# Altium schematic sheet DataDriven_sheet4_sim_connectors.SchDoc
size A3; SheetNumber: 4; SheetTotal: 4
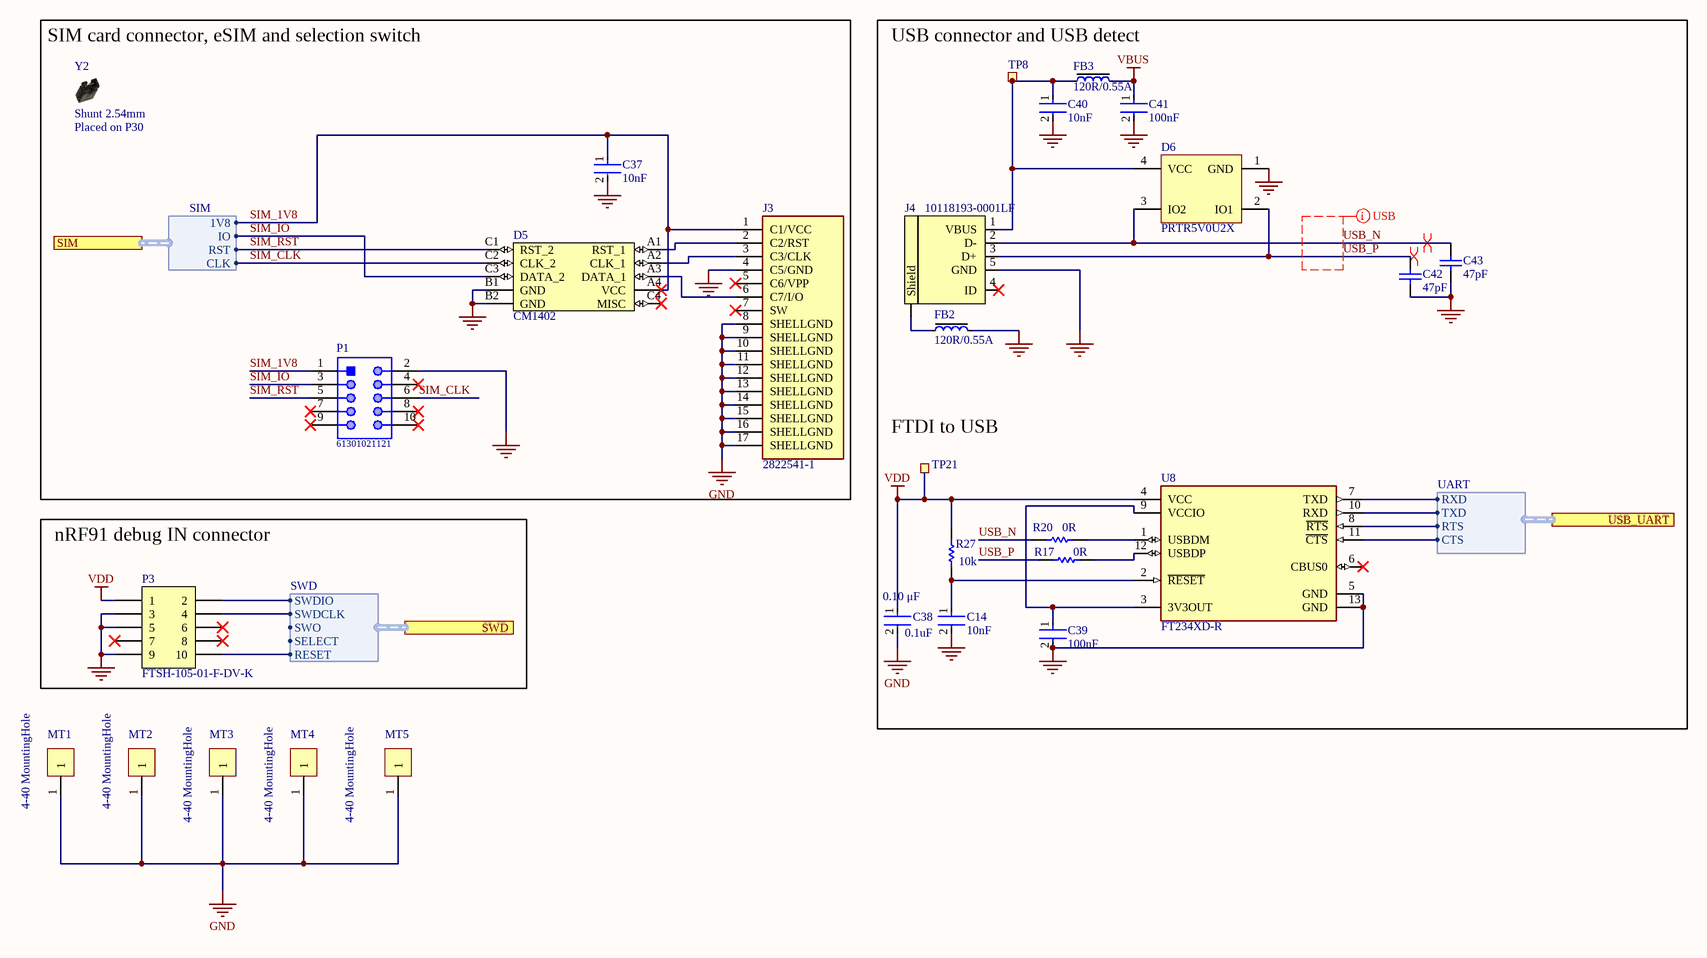
[diagram p0: DataDriven_sheet4_sim_connectors.SchDoc]

## Parts
C14  10nF  [FP-CC0603-DA-MFG]
C37  10nF  [FP-CC0603-DA-MFG]
C38  0.1uF  Capacitance: 0.10 μF  [FP-C0603C-CF-MFG]
C39  100nF  [FP-CGA3E-0_3-0_1-IPC_A]
C40  10nF  [FP-CC0603-DA-MFG]
C41  100nF  [FP-CGA3E-0_3-0_1-MFG]
C42  47pF  [CAPC1608X90X35ML10T15]
C43  47pF  [CAPC1608X90X35ML10T15]
D5  CM1402  [CM1402]
D6  PRTR5V0U2X  [SOT190P230X110-4L]
FB2  120R/0.55A  [INDC1005X04L]
FB3  120R/0.55A  [INDC1005X04L]
J3  2822541-1  [TE_2822541-1]
J4  10118193-0001LF  [USB-Micro-B-RA-SMD-PiP]
MT1  4-40 MountingHole  [4-40 Mounting Hole]
MT2  4-40 MountingHole  [4-40 Mounting Hole]
MT3  4-40 MountingHole  [4-40 Mounting Hole]
MT4  4-40 MountingHole  [4-40 Mounting Hole]
MT5  4-40 MountingHole  [4-40 Mounting Hole]
P1  61301021121  [61301021121]
P3  FTSH-105-01-F-DV-K  [HDR_2x5-SMD-1.27mm-K]
R17  0R  [RESC1608X55X25ML10T15]
R20  0R  [RESC1608X55X25ML10T15]
R27  10k  [RESC1609X55X30LL15T15]
TP8  Ø1.5mm,SMD  [TP_SMD_D1.5mm]  (value not drawn)  (no BOM)
TP21  Ø1.5mm,SMD  [TP_SMD_D1.5mm]  (value not drawn)  (no BOM)
U8  FT234XD-R  [FP-DFN-12-MFG]
Y2  Shunt 2.54mm  Assembly: Placed on P30  [Shunt_2.54mm_Horizontal]  (mechanical)

## Blocks framed on the sheet
SIM card connector, eSIM and selection switch: C37 D5 J3 P1 Y2
nRF91 debug IN connector: P3

## Ports
SIM (harness SIM, see DataDriven_sheet1_connections[3B], DataDriven_sheet2_nRF9160[7B]), SWD (harness SWD, see DataDriven_sheet1_connections[3B], DataDriven_sheet2_nRF9160[7A]), USB_UART (harness UART, see DataDriven_sheet1_connections[3B], DataDriven_sheet2_nRF9160[7A])

## Harnesses
SWD: SWDIO, SWDCLK, SWO, RESET, SELECT
SIM: CLK, IO, 1V8, RST
UART: RTS, CTS, RXD, TXD

## Nets
GND: C14.2 C37.2 C38.2 C39.2 C40.2 C41.2 C42.1 C43.1 D5.B1(GND) D5.B2(GND) D6.1(GND) FB2.2 J3.4(C5/GND) J3.8(SHELLGND) J3.9(SHELLGND) J3.10(SHELLGND) J3.11(SHELLGND) J3.12(SHELLGND) J3.13(SHELLGND) J3.14(SHELLGND) J3.15(SHELLGND) J3.16(SHELLGND) J3.17(SHELLGND) J4.5(GND) MT1.1 MT2.1 MT3.1 MT4.1 MT5.1 P1.2 P3.3 P3.5 P3.9 U8.5(GND) U8.13(GND)
VBUS: C41.1 FB3.2
VDD: C38.1 P3.1 R27.1 TP21.1 U8.4(VCC)
SIM_1V8: C37.1 D5.A4(VCC) J3.1(C1/VCC) P1.1 ; port SIM.1V8
SIM_CLK: D5.C2(CLK_2) P1.6 ; port SIM.CLK
SIM_IO: D5.C3(DATA_2) P1.3 ; port SIM.IO
SIM_RST: D5.C1(RST_2) P1.5 ; port SIM.RST
USB_N: C43.2 D6.3(IO2) J4.2(D-) R20.1
USB_P: C42.2 D6.2(IO1) J4.3(D+) R17.1
NetC14_1: C14.1 R27.2 U8.2(~{RESET})
NetC39_1: C39.1 U8.3(3V3OUT) U8.9(VCCIO)
NetC40_1: C40.1 D6.4(VCC) FB3.1 J4.1(VBUS) TP8.1
NetD5_A1: D5.A1(RST_1) J3.2(C2/RST)
NetD5_A2: D5.A2(CLK_1) J3.3(C3/CLK)
NetD5_A3: D5.A3(DATA_1) J3.6(C7/I/O)
NetFB2_1: FB2.1 J4.6(Shield)
NetP3_2: P3.2 ; port SWD.SWDIO
NetP3_4: P3.4 ; port SWD.SWDCLK
NetP3_10: P3.10 ; port SWD.RESET
NetR17_2: R17.2 U8.12(USBDP)
NetR20_2: R20.2 U8.1(USBDM)
NetU8_7: U8.7(TXD) ; port USB_UART.RXD
NetU8_8: U8.8(~{RTS}) ; port USB_UART.RTS
NetU8_10: U8.10(RXD) ; port USB_UART.TXD
NetU8_11: U8.11(~{CTS}) ; port USB_UART.CTS

Not connected (* = marked no-connect by the designer): D5 C4(MISC)*; J3 5(C6/VPP)* 7(SW)*; J4 4(ID)*; P1 4* 7* 8* 9* 10*; P3 6* 7* 8*; U8 6(CBUS0)*

## Layout directives
differential pair: USB_N, USB_P
net class USB: USB_N, USB_P

## Notes on the sheet
- USB connector and USB detect
- (near TP21) FTDI to USB

## Library data of the parts
C14 C37 C40 = CMP-2100-03600-2: CAP CER 10000PF 50V X7R 0603; Manufacturer Part Number: CC0603KRX7R9BB103; Manufacturer: YAGEO; Tolerance: 0.1; Material: Ceramic; Temperature Coefficient: 15%; Mouser Description: Multilayer Ceramic Capacitor, CC Series, 0.01 - F, - 10%, X7R, 50 V, 0603 [1608 Metric]; Digikey Description: CAP CER 10000PF 50V X7R 0603; Height: 0.9mm; Category: Cap; Temperature Characteristic: X7R; Footprint Url: http://www.yageo.com/exep/pages/download/literatures/UPY-C_GEN_24.pdf; Lead Free: Yes; Voltage Rating: 50 V; Temperature: -55°C to +125°C; Device Class L3: Ceramic Capacitors; ComponentLink2Description: Datasheet; Voltage: 50 V; Package: CC0603-DA; Octopart: https://octopart.com/cc0603krx7r9bb103-yageo-192938; Automotive: No; Temperature Range High: +125°C; Temperature Range Low: -55°C; Value: 10 nF; RoHS: TRUE; Device Class L1: Passive Components; ComponentLink2URL: http://www.yageo.com/documents/recent/UPY-GPHC_X7R_6.3V-to-50V_18.pdf; Device Class L2: Capacitors; Capacitance: 10 nF
  C37: Part Number: CC0603KRX7R9BB103
C38 = CMP-2006-03061-2: CAP CER 0.1UF 50V X7R 0603; Manufacturer: KEMET; Manufacturer Part Number: C0603C104K5RACTU; Tolerance: 0.1; Temperature Coefficient: 30ppm/°C; Material: Ceramic; Automotive Grade: Grade 1; Value: 0.10 μF; Temperature: -55°C to +125°C; RoHS: TRUE; Temperature Range High: +125°C; Lead Free: Yes; Octopart: https://octopart.com/c0603c104k5ractu-kemet-139244; Digikey Description: CAP CER 0.1UF 50V X7R 0603; Category: Cap; Package: C0603C-CF; ComponentLink2Description: Datasheet; Temperature Range Low: -55°C; Device Class L1: Passive Components; Voltage Rating: 50 V; Automotive: Yes; Device Class L3: Ceramic Capacitors; ComponentLink2URL: https://api.kemet.com/component-edge/download/datasheet/C0603C100J5GACAUTO.pdf; Device Class L2: Capacitors; Temperature Characteristic: X7R; Height: 0.87mm
C39 C41 = CMP-2000-07546-2: Cap Ceramic 100nF 50V X7R 10% Pad SMD 0603 +125°C Automotive T/R; Manufacturer: TDK; Manufacturer Part Number: CGA3E2X7R1H104K080AA; Weight: 7.1E-05oz; Composition: Ceramic; Max Operating Temperature: 125°C; Termination: SMD/SMT; Dielectric: X7R; Length: 1.6mm; Package Quantity: 1; REACH SVHC: No SVHC; Lead Free: Lead Free; Case Code (Metric): 1608; Min Operating Temperature: -55°C; Packaging: Tape and Reel; Tolerance: 10%; Voltage Rating: 50V; Case Code (Imperial): 0603; Capacitance: 100nF; Case/Package: 0603; Voltage Rating (DC): 50V; Depth: 0.8mm; Radiation Hardening: No; Ratings: AEC-Q200; Mount: Surface Mount; Voltage: 50V; Thickness: 0.035inch; Width: 0.8mm; Height: 0.8mm; Part Number: CGA3E2X7R1H104K080AA
  C41: Parameter 1: *
C42 C43 = CMP-2006-02672-1: 47 pF ±5% 50V Ceramic Capacitor C0G, NP0 0603 (1608 Metric); Manufacturer: Murata; Part Number: GRM1885C1H470JA01D; Manufacturer Part Number: GRM1885C1H470JA01D
D5 = CM1402: EMI Network Filter Arrays SIM CARD EMI FILTER WITH ESD PROTECTION; Manufacturer: ON Semiconductor; Manufacturer Part Number: CM1402-03CP; Part number IPS: 00000009949; Note: N.A.; Pad Count: 10; Part Number: CM1402; Footprint Doc: CM1402; LatestRevisionDate: 2017-02-06; Published: 2017-02-06; Value: CM1402; Artikkelnr Noca: N.A.; ComponentLink1URL: N.A.; ComponentLink1Description: Datasheet; ComponentLink2URL: N.A.; ComponentLink2Description: Supplier link; HelpURL: http://www.onsemi.com/pub_link/Collateral/CM1402-D.PDF; Supplier 1: Digi-Key; Supplier Part Number 1: CM1402-03CPOSTR-ND; Supplier 2: Mouser; Supplier Part Number 2: 748-CM1402-03CP; PartId: 101300139; Component Class: Semiconductors; Author: rsk; Part number Norautron: N.A.
D6 = PRTR5V0U2X: Ultra low capacitance double rail-to-rail ESD protection diode; Manufacturer: NXP Semiconductors; Part number IPS: 00000009951; Note: N.A.; Artikkelnr Noca: 10069015; Pad Count: 4; Part Number: PRTR5V0U2X; Manufacturer Part Number: PRTR5V0U2X; LatestRevisionDate: 2017-11-09; Published: 2012-06-11; Value: PRTR5V0U2X; Footprint Doc: SOT-143B; ComponentLink1URL: N.A.; ComponentLink1Description: Datasheet; ComponentLink2URL: N.A.; ComponentLink2Description: Supplier link; HelpURL: http://www.farnell.com/datasheets/109718.pdf; Supplier 1: Digi-Key; Supplier Part Number 1: 568-4140-1-ND; Supplier 2: Farnell; Supplier Part Number 2: 152-4157; PartId: 101300082; Component Class: Semiconductors; Author: rsk; Part number Norautron: N.A.
FB2 FB3 = FB0402-120R@100M-500mA: Ferrite Bead, 120 Ohm @ 100MHz, 500mA, 250 mOhm Max; Manufacturer: Murata; Manufacturer Part Number: BLM15AG121SN1D; Part number IPS: 00000009954; Part number Norautron: N.A.; Note: Chip EMIFIL Inductor Type Chip Ferrite Bead; Artikkelnr Noca: 33029317; Pad Count: 2; Part Number: FB0402-120R@100M-500mA; Footprint Doc: 0402; LatestRevisionDate: 2014-01-10; Published: 2011-11-14; Value: 120R/0.55A; ComponentLink1URL: N.A.; ComponentLink1Description: Datasheet; ComponentLink2URL: N.A.; ComponentLink2Description: Supplier link; HelpURL: http://search.murata.co.jp/Ceramy/image/img/PDF/ENG/L0110S0100BLM15A_SN.pdf; Supplier 1: Digi-Key; Supplier Part Number 1: 490-1005-1-ND; Supplier 2: Farnell; Supplier Part Number 2: 151-5760; PartId: 100300099; Component Class: Inductors; Author: rsk
J3 = 2822541-1: 7 _6 + 1_ Position Card Connector Micro SIM Surface Mount, Right Angle Gold; Manufacturer: TE Connectivity AMP Connectors; MF: TE Connectivity; Value: *; MP: 2822541-1; TE_purchase_URL: https://www.te.com/usa-en/product-2822541-1.html?te_bu=Cor&te_type=disp&te_campaign=seda_glo_cor-seda-global-disp-prtnr-fy19-seda-model-bom-cta_sma-317_1&elqCampaignId=32493; Package: None; SnapEDA_Link: https://www.snapeda.com/parts/2822541-1/TE%20Connectivity%20AMP%20Connectors/view-part/2624949/?ref=snap; Digi-Key_Part_Number: A141365CT-ND; Digi-Key_Purchase_URL: https://www.digikey.vn/product-detail/en/te-connectivity-amp-connectors/2822541-1/A141365CT-ND/9564398?utm_source=snapeda&utm_medium=aggregator&utm_campaign=symbol; Manufacturer Part Number: 2822541; Part Number: 2822541
J4 = USB-Micro-B-RA-SMD-PiP: USB - micro B USB 2.0 Receptacle Connector 5 Position Surface Mount, Right Angle; Through Hole; Manufacturer: Amphenol ICC (FCI); Part number IPS: 00000007790; Value: MicroUSB-B; Note: N.A.; Artikkelnr Noca: 55029020; Pad Count: 5; Part Number: 10118193-0001LF; Manufacturer Part Number: 10118193-0001LF; Footprint Doc: 10118193-0001LF; LatestRevisionDate: 2016-04-21; Published: 2014-10-07; ComponentLink1URL: N.A.; ComponentLink1Description: Datasheet; ComponentLink2URL: N.A.; ComponentLink2Description: Supplier link; HelpURL: \\hizz\pro\app9717\Datasheet\connectors\Allen Creations Corp\AJU-211.pdf; Supplier 1: Cabcon; Supplier Part Number 1: AJU55-BS2111-L; Supplier 2: Digi-Key; Supplier Part Number 2: 609-4616-1-ND; PartId: 100500490; Component Class: Connectors; Author: rsk; Part number Norautron: N.A.
MT1-MT5 = 4-40 MountingHole: 4-40 Mounting Hole
P1 = CMP-1502-01084-1: THT Vertical Pin Header WR-PHD, Pitch 2.54 mm, Dual Row, 10 pins; Manufacturer: Wurth Elektronik; Working Voltage: 250VAC; Pitch: 2.54mm; Contact Resistance: 20mOhm; Gender: Male; Rated Current: 3A; Withstanding Voltage: 500VAC; Pin Number: 10; Operating Temperature: -40to105degC; Mounting Technology: THT; Publisher: WurthElektronik; Manufacturer URL: http://www.we-online.de; Part Number: 61301021121; Row Number: Dual; Packaging: Bag; Orientation: Vertical; Package Reference: 61301021121; Datasheet URL: https://katalog.we-online.de/em/datasheet/6130xx21121.pdf; Manufacturer Part Number: 61301021121
P3 = Pin Header 2x5 SMD, 1.27mm, KS: Pin Header 2x5, 1.27mm (50mil), SMD, Keying Shroud; Manufacturer: Samtec; Part number IPS: 00000009968; Note: N.A.; Artikkelnr Noca: 55010009; Pad Count: 10; Part Number: Pin Header 2x5 SMD, 1.27mm, KS; Manufacturer Part Number: FTSH-105-01-F-DV-K; Footprint Doc: HDR_2x5-SMD-1.27mm; LatestRevisionDate: 2016-04-21; Published: 2016-01-22; Value: Pin Header 2x5, 1.27mm; ComponentLink1URL: N.A.; ComponentLink1Description: Datasheet; ComponentLink2URL: N.A.; ComponentLink2Description: Supplier link; HelpURL: \\hizz\pro\app9717\Datasheet\connectors\W-CON\3132-XXMXXBK00XX.pdf; Supplier 1: Cabcon; Supplier Part Number 1: 3132-10MS0BK00R1; Supplier 2: Samtec; Supplier Part Number 2: FTSH-105-01-F-DV-K; PartId: 100500261; Component Class: Connectors; Author: rsk; Part number Norautron: N.A.
R17 R20 = CMP-2100-03667-1: Chip Resistor, 0 Ohm, +/- 5%, 0.1 W, -55 to 155 degC, 0603 (1608 Metric), RoHS, Tape and Reel; Manufacturer: Yageo; Manufacturer Part Number: RC0603JR-070RL; Temperature Coefficient: 200ppm/degreesC; Voltage Rating: 50V; Power Rating: 100mW; Resistance: 0mOhm; Width: 0.8mm; Max Operating Temperature: 155degC; Tolerance: 5%; Package Reference: 0603; Height: 0.45mm; Depth: 0.8mm; Package Description: 2-Pin Surface Mount Device, Body 1.6 x 0.8 mm; Termination: SMD/SMT; Package Quantity: 5000; Case/Package: 0603; Case Code (Imperial): 0603; Radiation Hardening: No; Number of Pins: 2; Length: 1.6mm; Lead Free: LeadFree; Voltage Rating (DC): 50V; Military Standard: Not; Datasheet URL: http://www.yageo.com/NewPortal/yageodocoutput?fileName=/pdf/R-Chip/PYu-RC_Group_51_RoHS_L_5.pdf; Manufacturer URL: http://www.yageo.com/; Packaging: TapeandReel; Case Code (Metric): 1608; Min Operating Temperature: -55degC; Composition: ThickFilm; RoHSCompliant: true; Contact Plating: Tin; Datasheet Version: Rev. 5, 10/2016; REACH SVHC: NoSVHC; Part Number: RC0603JR-070RL
R27 = CMP-1012-00623-3: Chip Resistor, 10 KOhm, +/- 1%, 0.1 W, -55 to 155 degC, 0603 (1608 Metric), RoHS, Tape and Reel; Manufacturer: Panasonic; Manufacturer Part Number: ERJ-3EKF1002V; Voltage Rating: 75V; Case\/Package: 0603; Power Rating: 100mW; Resistance: 10KOhm; Temperature Coefficient: 100ppm\/degreesC; Number of Pins: 2; Package Reference: 603; Depth: 0.8mm; Mount: SurfaceMount; Package Description: 2-Pin Surface Mount Device, Body 1.6 x 0.85 mm; Datasheet Version: 02/2017; Length: 1.6mm; Lead Free: LeadFree; Height: 0.45mm; Number of Terminations: 2; Max Power Dissipation: 100mW; Min Operating Temperature: -55degC; Datasheet URL: https://industrial.panasonic.com/cdbs/www-data/pdf/RDA0000/AOA0000C304.pdf; Termination: SMD/SMT; Case Code (Metric): 1608; Case Code (Imperial): 0603; Tolerance: 1%; Max Operating Temperature: 155degC; RoHSCompliant: true; Voltage Rating (DC): 75V; Radiation Hardening: No; Packaging: TapeandReel; Composition: ThickFilm; Mounting Technology: SurfaceMount; Manufacturer URL: http://www.panasonic.com/; Width: 0.031inch; REACH SVHC: NoSVHC; Contact Plating: Tin; Military Standard: Not; Package Quantity: 1; Part Number: ERJ-3EKF1002V
TP8 TP21 = TP_SMD_Ø1.5MM: 1.5mm circular SMD testpad; Manufacturer: Nordic Semiconductor; Manufacturer Part Number: NRF9160-SICA-B1A-R; Note: N.A.; Pad Count: 1; Part Number: TP_SMD_Ø1.5MM; ComponentLink1URL: N.A.; ComponentLink1Description: Datasheet; ComponentLink2URL: N.A.; ComponentLink2Description: Supplier link; HelpURL: N.A.; Footprint Doc: TP_SMD_Ø1.5mm; LatestRevisionDate: 2021-03-05; Published: 2016-06-02; Value: Ø1.5mm,SMD; Artikkelnr Noca: N.A.; Part number IPS: N.A.; Supplier 1: N.A.; Supplier Part Number 1: N.A.; Supplier 2: N.A.; Supplier Part Number 2: N.A.; PartId: 100500477; Component Class: Connectors; Author: rsk; Part number Norautron: N.A.
U8 = CMP-0248-00027-3: IC USB SERIAL BASIC UART 12DFN; Manufacturer: FTDI; Min Supply Voltage: 2.97V; Number of Ports: 1; Operating Supply Voltage: 5V; Operating Supply Current: 8mA; Max Supply Voltage: 5.5V; Data Rate: 3Mbps; Length: 3mm; Case/Package: DFN; Mount: Surface Mount; Packaging: Tape and Reel; Max Operating Temperature: 85°C; Height: 0.75mm; Number of Pins: 12; Number of Transceivers: 1; Package Quantity: 5000; Min Operating Temperature: -40°C; Width: 3mm; REACH SVHC: No SVHC; Interface: UART; Lead Free: Lead Free; Manufacturer Part Number: FT234XD-R; Part Number: FT234XD-R
Y2 = SHUNT JUMPER 2.54mm BLACK GOLD Horizontal (obsolete): Shunt Jumper 2.54mm Black; Part Number: SNT-100-RD-G; Manufacturer: Samtec; Part number IPS: 00000001916; Part number Norautron: N.A.; Note: SHUNT JUMPER .1" BLACK GOLD, h=6.00mm, w=5.00mm; Artikkelnr Noca: 56099001; Pad Count: 2; Manufacturer Part Number: SNT-100-RD-G; ComponentLink1URL: N.A.; ComponentLink1Description: Datasheet; ComponentLink2URL: N.A.; ComponentLink2Description: Supplier link; HelpURL: N.A.; Footprint Doc: SHUNT JUMPER 2.54mm; LatestRevisionDate: 2021-06-28; Published: 2019-09-04; Value: Shunt 2.54mm; Supplier 1: Digi-Key; Supplier Part Number 1: SAM10727-ND; Supplier 2: N.A.; Supplier Part Number 2: N.A.; PartId: 100500644; Component Class: Connectors; Author: rsk